# EAGLE design untitled (EAGLE 7.1.0)
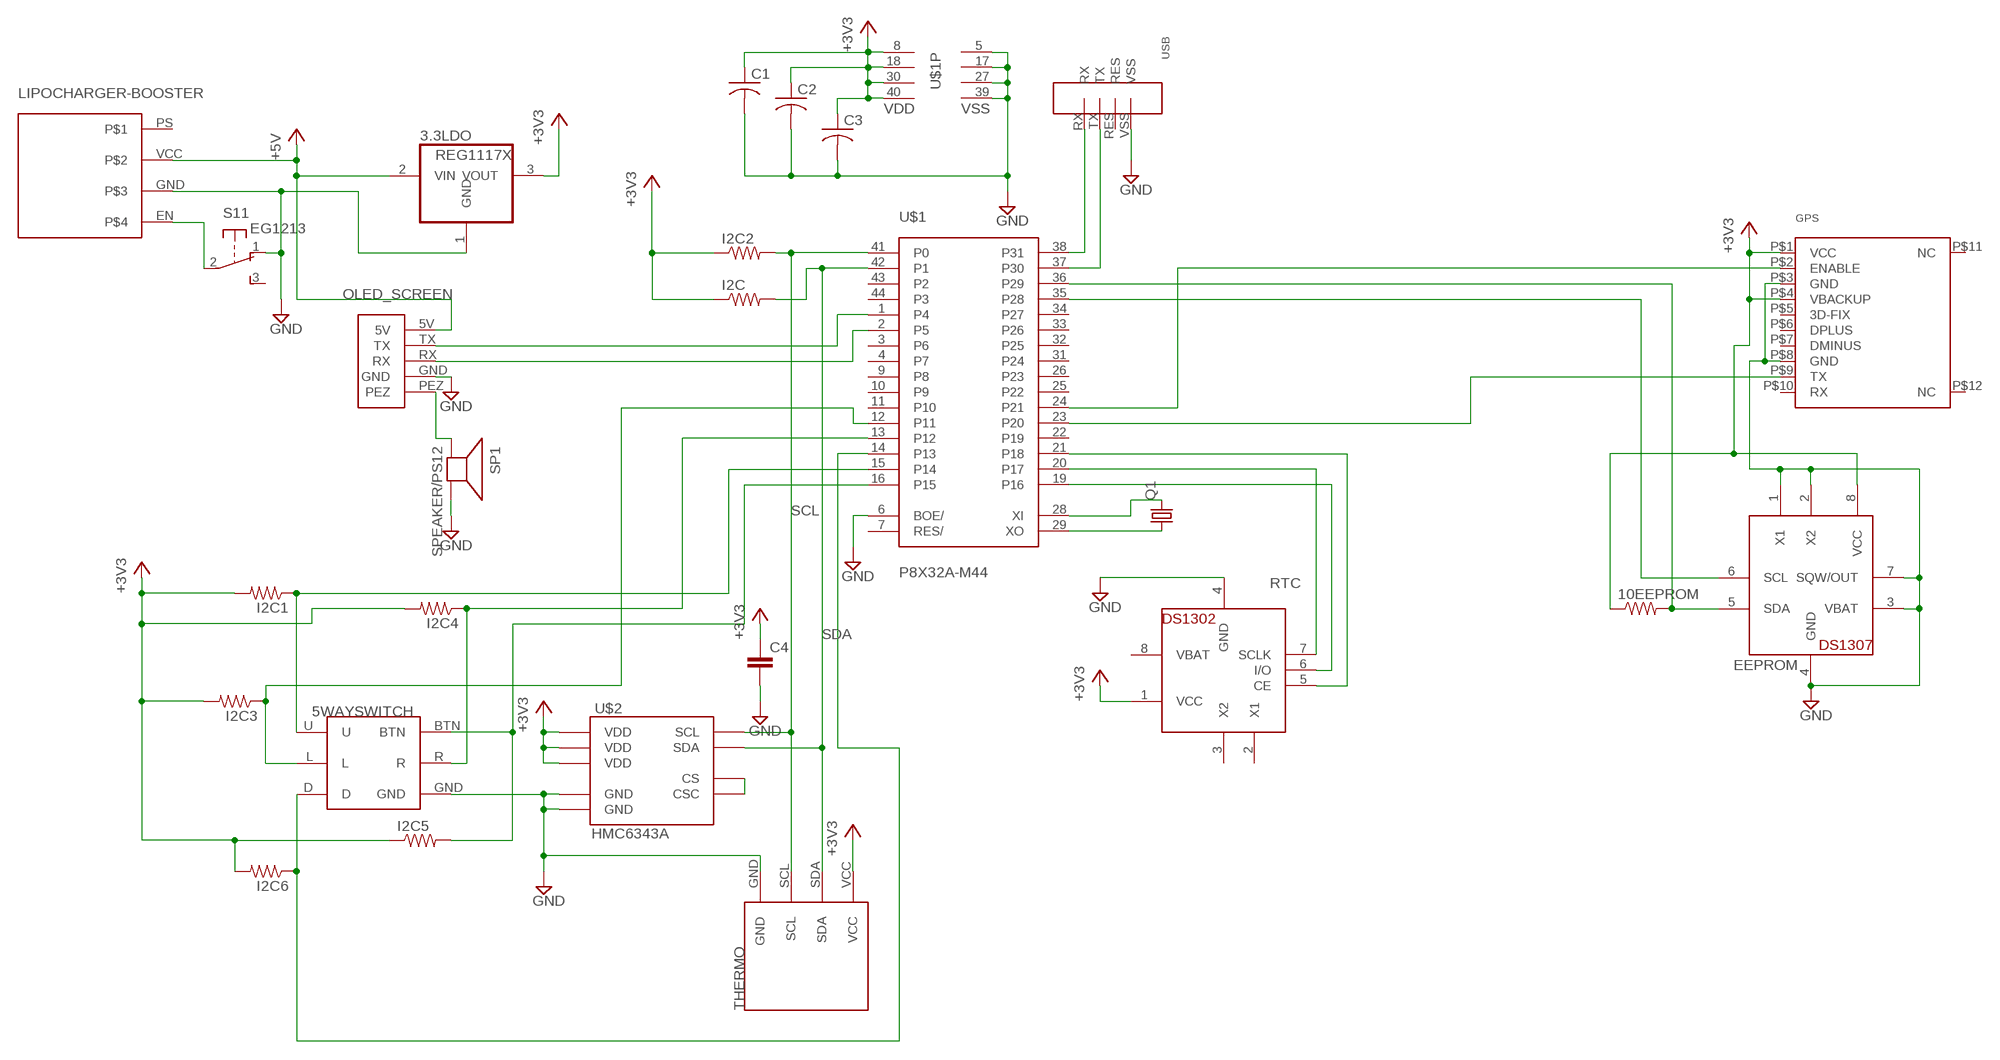
[diagram p0: schematic, sheet 1]

## Parts
3.3LDO  REG1117X  [TO252]
5WAYSWITCH  5-WAYSWITCH  [5-WAYSWITCH]
10EEPROM  R-US_R1005  [R1005]
C1  C-USC0603  [C0603]
C2  C-USC0603  [C0603]
C3  C-USC0603  [C0603]
C4  CAP0603  [0603]
EEPROM  DS1307  [DIL08]
GPS  GPS_FGPMMOPA6B  [FGPMMOPA6B]
I2C  R-US_R1005  [R1005]
I2C1  R-US_R1005  [R1005]
I2C2  R-US_R1005  [R1005]
I2C3  R-US_R1005  [R1005]
I2C4  R-US_R1005  [R1005]
I2C5  R-US_R1005  [R1005]
I2C6  R-US_R1005  [R1005]
LIPOCHARGER-BOOSTER  SFLIPO  [SFLIPO]
OLED_SCREEN  4DSCREEN  [4DSCREEN]
Q1  CRYSTALHC49S  [HC49/S]
RTC  DS1302  [DIL08-ROUND]
S1  EG1213  [EG1213]
SP1  SPEAKER/PS12  [PS12]
THERMO  SFTEMP  [SFTEMP]
U$1  P8X32A-M44  [P8X32A-M44]
U$2  HMC6343A  [LCC36]
USB  4PINUSB  [4PINUSB]

## Nets
+3V3: 3.3LDO.3(VOUT) 10EEPROM.1 C1.1 C2.1 C3.1 C4.1 EEPROM.8(VCC) GPS.P$1(VCC) GPS.P$4(VBACKUP) I2C1.2 I2C2.1 I2C3.2 I2C4.2 I2C5.1 I2C6.2 I2C.1 RTC.1(VCC) THERMO.VCC U$1.8(VDD) U$1.18(VDD) U$1.30(VDD) U$1.40(VDD) U$2.3(VDD) U$2.11(VDD) U$2.21(VDD)
+5V: 3.3LDO.2(VIN) LIPOCHARGER-BOOSTER.VCC OLED_SCREEN.5V
GND: 3.3LDO.1(GND) 5WAYSWITCH.GND C1.2 C2.2 C3.2 C4.2 EEPROM.1(X1) EEPROM.2(X2) EEPROM.3(VBAT) EEPROM.4(GND) EEPROM.7(SQW/OUT) GPS.P$3(GND) GPS.P$8(GND) LIPOCHARGER-BOOSTER.GND OLED_SCREEN.GND RTC.4(GND) S1.1(1:O) SP1.P$2(-) THERMO.GND U$1.5(VSS) U$1.6(BOE/) U$1.17(VSS) U$1.27(VSS) U$1.39(VSS) U$2.25(GND) U$2.29(GND) USB.VSS
N$1: Q1.2 U$1.28(XI)
N$2: Q1.1 U$1.29(XO)
N$3: GPS.P$9(TX) U$1.23(P20)
N$4: GPS.P$2(ENABLE) U$1.24(P21)
N$5: RTC.5(CE) U$1.21(P18)
N$6: RTC.6(I/O) U$1.19(P16)
N$7: U$1.38(P31) USB.RX
N$8: RTC.7(SCLK) U$1.20(P17)
N$9: U$1.37(P30) USB.TX
N$10: OLED_SCREEN.RX U$1.2(P5)
N$11: OLED_SCREEN.TX U$1.1(P4)
N$12: OLED_SCREEN.PEZ SP1.P$1(+)
N$13: LIPOCHARGER-BOOSTER.EN S1.2(1:P)
N$14: 5WAYSWITCH.U I2C1.1 U$1.15(P14)
N$15: 5WAYSWITCH.D I2C6.1 U$1.14(P13)
N$17: 5WAYSWITCH.L I2C3.1 U$1.12(P11)
N$18: 10EEPROM.2 EEPROM.5(SDA) U$1.36(P29)
N$19: EEPROM.6(SCL) U$1.35(P28)
N$20: 5WAYSWITCH.R I2C4.1 U$1.13(P12)
N$21: 5WAYSWITCH.BTN I2C5.2 U$1.16(P15)
N$22: U$2.22(CS) U$2.35(CSC)
SCL: I2C2.2 THERMO.SCL U$1.41(P0) U$2.32(SCL)
SDA: I2C.2 THERMO.SDA U$1.42(P1) U$2.36(SDA)
Unconnected: GPS.P$5(3D-FIX) GPS.P$6(DPLUS) GPS.P$7(DMINUS) GPS.P$10(RX) GPS.P$11(NC) GPS.P$12(NC) LIPOCHARGER-BOOSTER.PS RTC.2(X1) RTC.3(X2) S1.3(1:S) S1.MT1(MT) S1.MT2(MT) U$1.3(P6) U$1.4(P7) U$1.7(RES/) U$1.9(P8) U$1.10(P9) U$1.11(P10) U$1.22(P19) U$1.25(P22) U$1.26(P23) U$1.31(P24) U$1.32(P25) U$1.33(P26) U$1.34(P27) U$1.43(P2) U$1.44(P3) USB.RES

## Power pins joined to a net without a drawn wire
VBAT: RTC.8(VBAT)

## Library data of the parts
3.3LDO = burr-brown:REG1117: 800mA and 1A Low Dropout (LDO) Positive Regulator 1.8V, 2.5V, 2.85V, 3.3V, 5V, and Adj
5WAYSWITCH = 5-wayswitch:5-WAYSWITCH
10EEPROM I2C I2C1-I2C6 = adafruit:R-US_: RESISTOR, American symbol
C1-C3 = rcl:C-US: CAPACITOR, American symbol
C4 = SparkFun:CAP: Capacitor Standard 0603 ceramic capacitor, and 0.1" leaded capacitor.
EEPROM = adafruit:DS1307: DS1307 Real time clock (RTC) with battery backup ability. Talk to it via i2c
GPS = adafruit:GPS_FGPMMOPA6B: FGPMMOPA6B 16x16x0.6mm GPS Module NMEA Sentences: GGA, GSA, GSV, RMC, VTG General Specifications Chipset: MTK MT3329 Baud Rate: 9600bps (default) Update Rate: 1Hz (default) Cold Start: ~35s Operating Temp: -40 to 85°C DC Characteristics Supply Voltage: 3.2-5.0V Backup Battery Voltage: 2.0-4.3V Digital Logic (UART): 3.3V I(Tracking): 42mA I(Acquisition): 53mA I(BackupBattery): 10uA
LIPOCHARGER-BOOSTER = SFLipoPack:SFLIPO
OLED_SCREEN = 4dScreen:4DSCREEN
Q1 = crystal:CRYSTAL: CRYSTAL; OC_FARNELL: 1667008; OC_NEWARK: unknown
RTC = adafruit:DS1302: DS1302 - Real time clock with supercap trickle charger
S1 = adafruit:EG1213: E-Switch right-angle slide SPDT Part #EG1213 http://www.ladyada.net/library/eagle
SP1 = adafruit:SPEAKER: SPEAKER Source: Buerklin Added PS12 (for part # PS1240 piezo) http://www.ladyada.net/library/pcb/eaglelibrary.html
THERMO = SFTemp:SFTEMP
U$1 = parallax_propeller:P8X32A-M44
U$2 = SparkFun:HMC6343
USB = 4pinUSB:4PINUSB

## Board
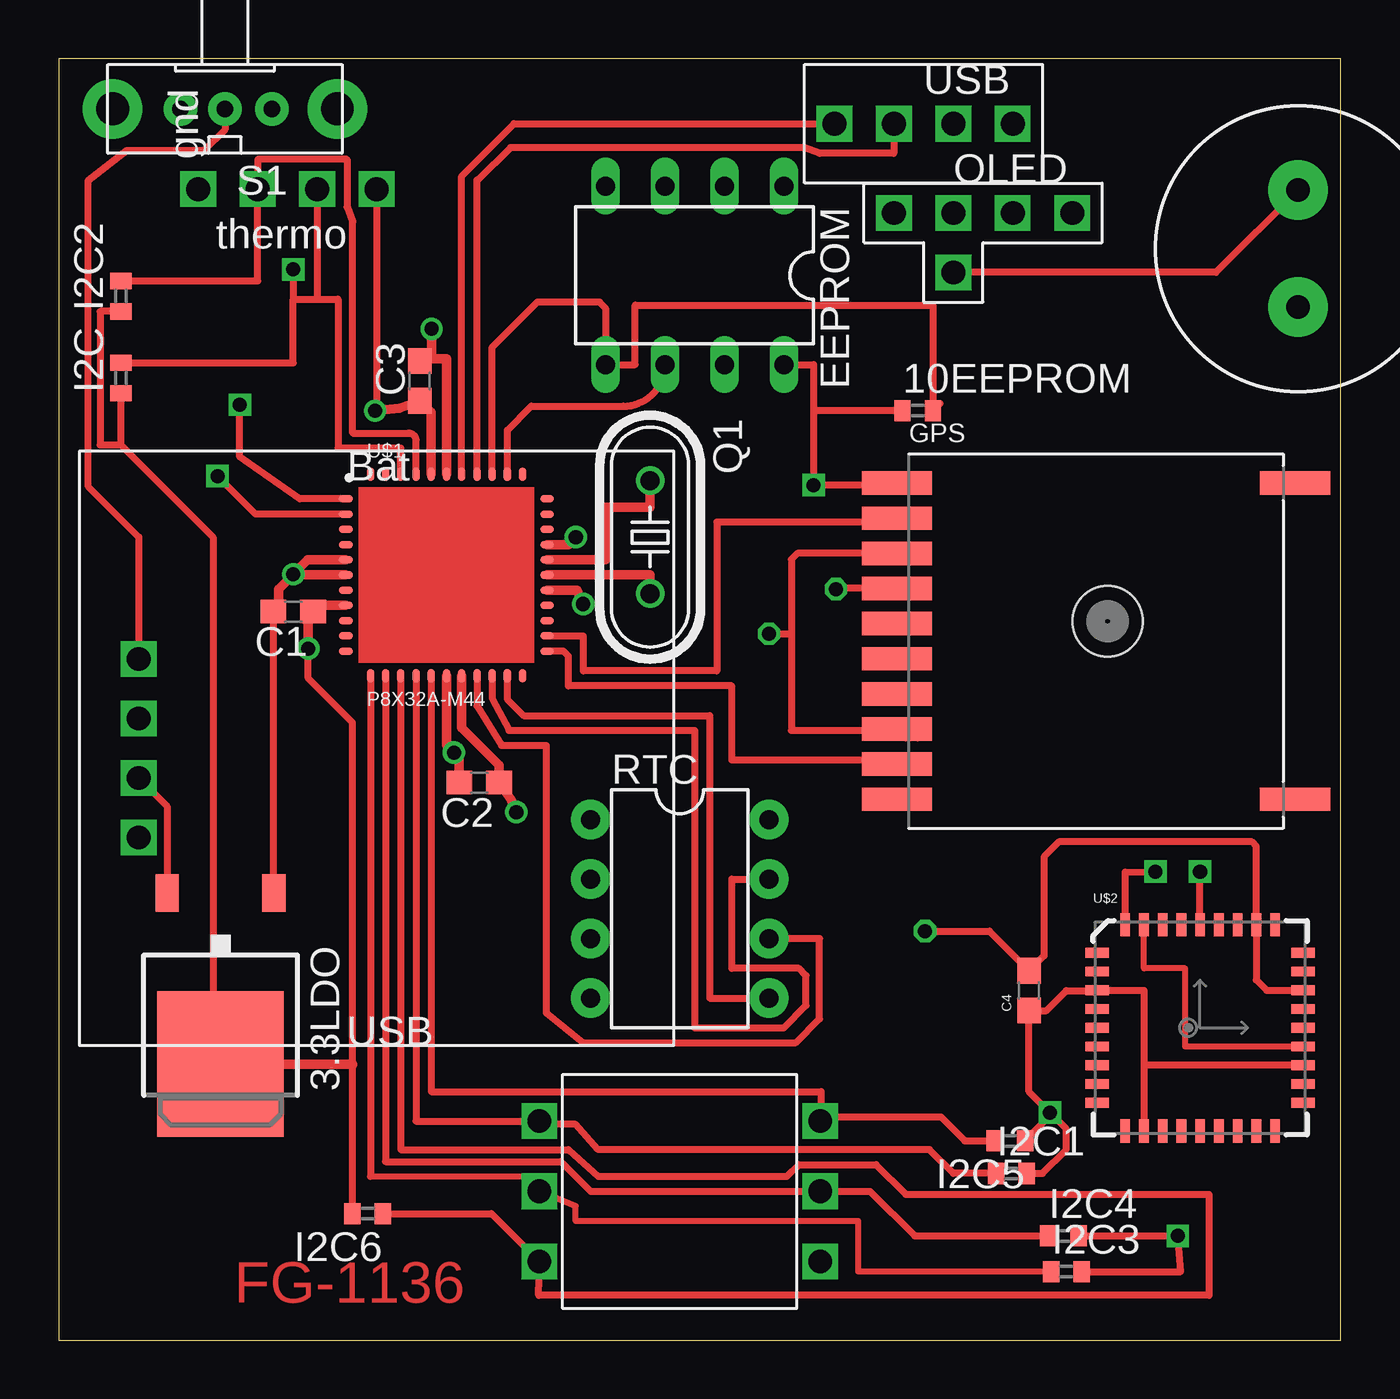
[diagram p1: board, top side]
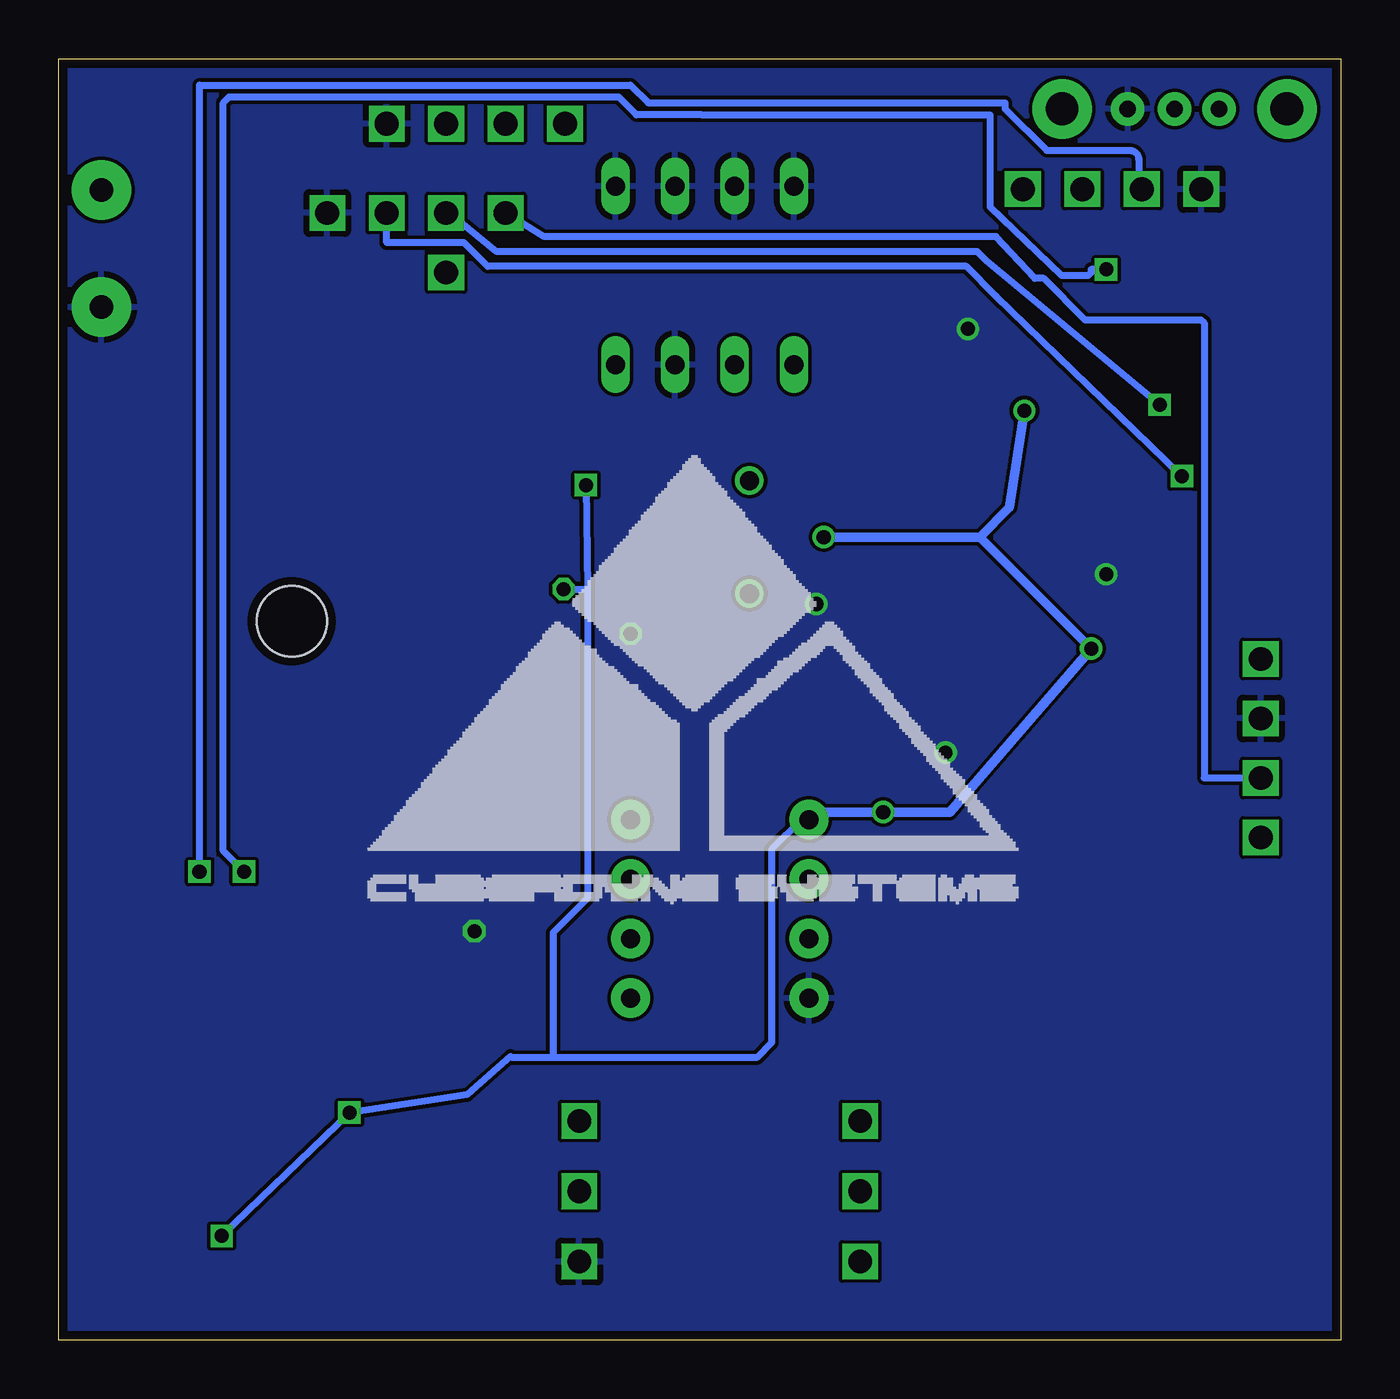
[diagram p2: board, bottom side, seen from below]

Size 54.79 x 54.73 mm. Coordinates in mm from the lower left corner, seen from the top.
Outline: 0,0 54.79,0 54.79,54.73 0,54.73 0,0
Copper layers (1*16): Top 0.0356mm / dielectric 1.5011mm / Bottom 0.0356mm
Design rules "LaenPCBOrder": minimum track width 6mil, minimum drill 13mil, track to track 6mil, track to pad 6mil, pad to pad 6mil, via to via 6mil, smd to smd 6mil, copper to edge 15mil, drill to drill 6mil, minimum pad ring 7mil, minimum via ring 7mil, stop-mask expansion 3mil, vias tented up to drill 0mil, thermal gap 10mil

### Footprints (pad centres in the part's own frame; a part is rotated, then mirrored left to right if it is on the bottom)
TO252 = smd 1 x 1.6: 1 -2.28,-4.8; 2 2.28,-4.8 | smd 5.4 x 6.2: 3 0,2.5
5-WAYSWITCH = drill 1.016 square: BTN 6,3; D -6,-3; GND 6,-3; L -6,0; R 6,0; U -6,3
R1005 = smd 0.7 x 0.9: 1 -0.65,0; 2 0.65,0
C0603 = smd 1.1 x 1: 1 -0.85,0; 2 0.85,0
0603 = smd 1.1 x 1: 1 -0.85,0; 2 0.85,0
DIL08 = drill 0.813 long: 1 -3.81,-3.81; 2 -1.27,-3.81; 3 1.27,-3.81; 4 3.81,-3.81; 5 3.81,3.81; 6 1.27,3.81; 7 -1.27,3.81; 8 -3.81,3.81
FGPMMOPA6B = smd 3 x 1: P$1 -8.5,6.75; P$2 -8.5,5.25; P$3 -8.5,3.75; P$4 -8.5,2.25; P$5 -8.5,0.75; P$6 -8.5,-0.75; P$7 -8.5,-2.25; P$8 -8.5,-3.75; P$9 -8.5,-5.25; P$10 -8.5,-6.75; P$11 8.5,6.75; P$12 8.5,-6.75 | hole 3: 0.5,0.85
SFLIPO = drill 1.016 square: EN -5.08,2.54; GND -5.08,0; PS -5.08,-5.08; VCC -5.08,-2.54
4DSCREEN = drill 1.016 square: 5V 0,-5.08; GND 0,2.54; PEZ 2.54,-2.54; RX 0,0; TX 0,-2.54
HC49/S = drill 0.813: 1 -2.413,0; 2 2.413,0
DIL08-ROUND = drill 0.813 pad 1.676: 1 -3.81,-3.81; 2 -1.27,-3.81; 3 1.27,-3.81; 4 3.81,-3.81; 5 3.81,3.81; 6 1.27,3.81; 7 -1.27,3.81; 8 -3.81,3.81
EG1213 = drill 0.7 pad 1.422: 1 -2,0; 2 0,0; 3 1.9,0 | drill 1.4 pad 2.54: MT1 -4.8,0; MT2 4.8,0
PS12 = drill 1 pad 2.54: P$1 -2.5,0; P$2 2.5,0
SFTEMP = drill 1.016 square: GND 0,2.54; SCL 0,0; SDA 0,-2.54; VCC 0,-5.08
P8X32A-M44 = smd 0.6 x 0.33: 1 -4.11,2.901; 2 -4.11,2.251; 3 -4.11,1.601; 4 -4.11,0.951; 5 -4.11,0.301; 6 -4.11,-0.349; 7 -4.11,-0.999; 8 -4.11,-1.649; 9 -4.11,-2.299; 10 -4.11,-2.949; 11 -4.11,-3.599; 23 4.49,-3.599; 24 4.49,-2.949; 25 4.49,-2.299; 26 4.49,-1.649; 27 4.49,-0.999; 28 4.49,-0.349; 29 4.49,0.301; 30 4.49,0.951; 31 4.49,1.601; 32 4.49,2.251; 33 4.49,2.901 | smd 0.33 x 0.6: 12 -3.06,-4.649; 13 -2.41,-4.649; 14 -1.76,-4.649; 15 -1.11,-4.649; 16 -0.46,-4.649; 17 0.19,-4.649; 18 0.84,-4.649; 19 1.49,-4.649; 20 2.14,-4.649; 21 2.79,-4.649; 22 3.44,-4.649; 34 3.44,3.951; 35 2.79,3.951; 36 2.14,3.951; 37 1.49,3.951; 38 0.84,3.951; 39 0.19,3.951; 40 -0.46,3.951; 41 -1.11,3.951; 42 -1.76,3.951; 43 -2.41,3.951; 44 -3.06,3.951
LCC36 = smd 1 x 0.42: 1 -4.4,3.2; 2 -4.4,2.4; 3 -4.4,1.6; 4 -4.4,0.8; 5 -4.4,0; 6 -4.4,-0.8; 7 -4.4,-1.6; 8 -4.4,-2.4; 9 -4.4,-3.2; 19 4.4,-3.2; 20 4.4,-2.4; 21 4.4,-1.6; 22 4.4,-0.8; 23 4.4,0; 24 4.4,0.8; 25 4.4,1.6; 26 4.4,2.4; 27 4.4,3.2 | smd 0.42 x 1: 10 -3.2,-4.4; 11 -2.4,-4.4; 12 -1.6,-4.4; 13 -0.8,-4.4; 14 0,-4.4; 15 0.8,-4.4; 16 1.6,-4.4; 17 2.4,-4.4; 18 3.2,-4.4; 28 3.2,4.4; 29 2.4,4.4; 30 1.6,4.4; 31 0.8,4.4; 32 0,4.4; 33 -0.8,4.4; 34 -1.6,4.4; 35 -2.4,4.4; 36 -3.2,4.4
4PINUSB = drill 1.016 square: RES 0,1.27; RX 0,-3.81; TX 0,-1.27; VSS 0,3.81

### Placement (x,y rotation side)
3.3LDO  6.92,14.29 180 top
5WAYSWITCH  26.54,6.35 0 top
10EEPROM  36.7,39.69 0 top
C1  10.03,31.11 180 top
C2  17.97,23.81 180 top
C3  15.43,40.96 90 top
C4  41.47,14.92 90 top
EEPROM  27.18,45.47 180 top
GPS  44.32,29.85 0 top
I2C  2.67,41.08 90 top
I2C1  40.7,7.11 0 top
I2C2  2.67,44.58 90 top
I2C3  43.05,2.92 0 top
I2C4  42.93,4.45 0 top
I2C5  40.64,8.51 180 top
I2C6  13.21,5.4 180 top
LIPOCHARGER-BOOSTER  8.51,26.54 0 top
OLED_SCREEN  40.77,48.13 270 top
Q1  25.27,34.29 270 top
RTC  26.54,18.41 270 top
S1  7.11,52.58 180 top
SP1  52.96,46.61 270 top
THERMO  8.51,49.15 90 top
U$1  16.38,33.02 0 top
U$2  48.77,13.34 0 top
USB  36.96,51.94 270 top

### Tracks (layer width: path | path; a pad name or v marks a point on that pad's centre or on a via)
+3V3  (via drill 0.6)
  Top 0.305: I2C3.2 47.94,2.92 v47.82,4.45 I2C4.2 | I2C6.2 12.56,11.75 | 12.56,11.79 12.56,26.37 10.67,28.26 v10.67,29.53 | GPS.P$1 35.74,36.51 v32.26,36.51 32.26,39.69 | 10EEPROM.1 32.26,39.69 | U$2.21 46.37,11.73 | 46.37,11.73 U$2.11 | 46.37,11.73 46.37,14.93 U$2.3 44.35,14.92 43.05,14.92 42.2,14.07 C4.1 41.46,10.61 v42.35,9.71 | GPS.P$4 33.24,32.09 v33.21,32.07 | 7.49,11.79 6.6,12.68 6.6,34.29 2.67,38.23 | THERMO.VCC 13.59,39.75 v13.53,39.69 | I2C.1 2.67,38.23 | I2C2.1 1.78,43.93 1.78,38.23 2.67,38.23 | EEPROM.8 32.26,41.66 32.26,39.69 | I2C5.1 42.35,9.57 v42.35,9.71 | I2C1.2 42.04,7.11 43.05,8.13 43.05,9.02 v42.35,9.71
  Top 0.406: U$1.8 10.88,31.37 C1.1 10.67,30.9 v10.67,29.53 | v19.56,22.54 19.34,23.07 C2.1 18.82,24.55 17.22,26.15 U$1.18 | U$1.30 21.78,33.97 v22.1,34.29 | v13.53,39.69 14.58,39.79 C3.1 15.92,39.61 U$1.40 | 3.3LDO.3 7.49,11.79 12.56,11.79 12.56,11.75
  Bottom 0.305: v47.82,4.45 v42.35,9.71 37.34,10.48 35.47,12.11 35.43,12.07 33.66,12.07 | v32.26,36.51 32.19,32.07 | v33.21,32.07 32.19,32.07 | RTC.1 23.05,22.22 24.32,20.95 24.32,12.7 24.96,12.07 33.66,12.07 | 32.19,32.07 32.19,18.86 33.66,17.4 33.66,12.07
  Bottom 0.406: v22.1,34.29 15.43,34.29 | 15.43,34.29 v10.67,29.53 16.7,22.54 v19.56,22.54 22.73,22.54 RTC.1 | v13.53,39.69 14.16,35.56 15.43,34.29
+5V
  Top 0.305: LIPOCHARGER-BOOSTER.VCC 4.64,22.79 3.3LDO.2
  Bottom 0.305: LIPOCHARGER-BOOSTER.VCC 5.84,24 5.84,43.43 5.97,43.56 10.92,43.56 12.7,45.34 13.08,45.34 14.73,47.12 34.04,47.12 OLED_SCREEN.5V
GND  (via drill 0.6)
  Top 0.305: U$2.25 51.61,14.93 51.17,15.38 U$2.29 51.17,21.09 50.99,21.27 42.74,21.27 42.1,20.64 42.1,16.41 C4.2 39.77,17.46 v37.02,17.46 | 37.02,26.04 36.7,25.72 36.38,25.72 | 36.38,25.72 36.2,25.72 GPS.P$8 | GPS.P$3 31.56,33.59 31.3,33.34 31.3,30.16 | 31.3,30.16 31.3,26.04 36.07,26.04 36.38,25.72 | v30.35,30.16 31.3,30.16 | 3.3LDO.1 9.18,19.09 C1.2
  Top 0.406: U$1.39 16.57,41.91 16,41.91 | U$1.6 10,32.67 | 10,32.67 9.4,32.07 9.4,31.33 C1.2 | U$1.5 10.65,33.32 v10.03,32.7 10,32.67 | U$1.27 22.14,32.02 v22.42,31.43 | C3.2 15.43,41.91 16,41.91 | U$1.17 16.57,25.4 v16.89,25.08 17.12,24.85 C2.2 | v15.94,43.18 15.94,41.97 16,41.91
  pour Bottom: 0.51,54.48 54.67,54.48 54.42,0.25 0.51,0.13
N$1
  Top 0.406: U$1.28 25.27,32.67 Q1.2
N$2
  Top 0.406: U$1.29 23.37,33.32 23.37,35.56 25.27,35.56 Q1.1
N$3
  Top 0.305: GPS.P$9 35.65,24.76 28.77,24.76 28.77,27.94 21.78,27.94 21.78,29.21 21.57,29.42 U$1.23
N$4
  Top 0.305: GPS.P$2 35.65,34.92 28.13,34.92 28.13,28.57 22.42,28.57 22.42,30.07 U$1.24
N$5
  Top 0.305: RTC.5 27.81,14.61 27.81,26.67 19.88,26.67 19.17,27.37 U$1.21
N$6
  Top 0.305: RTC.6 32.51,17.14 32.51,13.72 31.5,12.7 22.42,12.7 20.83,13.97 20.83,25.4 18.92,25.4 17.87,27.08 U$1.19
N$7
  Top 0.305: U$1.38 17.22,49.71 19.46,51.94 USB.RX
N$8
  Top 0.305: RTC.7 28.77,19.68 28.77,15.88 31.62,15.88 31.94,15.56 31.94,14.29 30.99,13.34 27.18,13.34 27.18,26.04 19.24,26.04 18.52,27.39 U$1.20
N$9
  Top 0.305: U$1.37 17.87,49.53 17.91,49.53 19.3,50.93 31.88,50.93 32.51,50.67 35.69,50.67 USB.TX
N$10  (via drill 0.6)
  Top 0.305: U$1.2 8.42,35.27 v6.8,36.89
  Bottom 0.305: v6.8,36.89 14.73,44.58 16,45.85 36.45,45.85 37.46,46.86 40.77,46.86 OLED_SCREEN.RX
N$11  (via drill 0.6)
  Top 0.305: U$1.1 10.31,35.92 7.75,37.72 v7.75,39.94
  Bottom 0.305: v7.75,39.94 15.02,45.98 15.15,46.1 15.53,46.48 36.07,46.48 38.1,48.13 OLED_SCREEN.TX
N$12
  Top 0.305: SP1.P$1 49.44,45.59 OLED_SCREEN.PEZ
N$13
  Top 0.305: S1.2 7.11,51.69 6.22,50.8 2.92,50.8 1.27,49.53 1.27,36.45 3.43,34.29 LIPOCHARGER-BOOSTER.EN
N$14
  Top 0.305: U$1.15 15.27,9.35 5WAYSWITCH.U 20.69,9.21 22.1,9.21 23.05,8.13 37.21,8.13 38.23,7.11 I2C1.1
N$15
  Top 0.305: U$1.14 14.62,8.13 21.78,8.13 23.05,6.98 31.12,6.98 31.62,7.49 34.93,7.49 36.2,6.22 49.15,6.22 49.15,1.9 20.51,1.9 5WAYSWITCH.D 18.5,5.4 I2C6.1
N$17
  Top 0.254: I2C3.1 34.16,2.92 34.16,5.08 22.1,5.08 22.1,5.71 5WAYSWITCH.L 20.54,6.98 13.32,6.98
  Top 0.305: U$1.12 13.32,6.98
N$18
  Top 0.305: 37.67,40 10EEPROM.2 37.35,44.2 24.64,44.2 24.64,41.66 EEPROM.5 23.37,44.07 23.11,44.32 20.45,44.32 18.52,42.4 U$1.36
N$19
  Top 0.305: U$1.35 19.18,38.86 20.19,39.88 24.13,39.88 arc90 EEPROM.6
N$20
  Top 0.305: U$1.13 13.97,7.62 21.46,7.62 22.73,6.35 5WAYSWITCH.R | 32.58,6.35 5WAYSWITCH.R | I2C4.1 36.58,4.45 34.67,6.35 5WAYSWITCH.R
N$21
  Top 0.254: 32.54,9.52 5WAYSWITCH.BTN
  Top 0.305: U$1.16 15.92,10.61 32.58,10.61 32.58,9.35 5WAYSWITCH.BTN | 32.54,9.52 37.7,9.52 38.72,8.51 I2C5.2
N$22
  Top 0.254: U$2.22 48.13,12.54 48.13,15.88 46.37,15.88 U$2.35
SCL  (via drill 0.6)
  Top 0.305: U$1.41 15.27,38.42 arc90 14.96,38.73 12.57,38.73 12.57,47.75 12.32,48.39 12.32,50.42 8.51,50.42 THERMO.SCL 8.51,45.23 I2C2.2 | U$2.32 v48.77,20
  Bottom 0.305: THERMO.SCL arc90 8.64,49.28 8.64,50.42 arc-90 9.02,50.8 12.57,50.8 14.35,52.58 14.35,52.83 29.59,52.83 30.35,53.59 48.77,53.59 v48.77,20
SDA  (via drill 0.6)
  Top 0.305: U$1.42 14.62,38.1 11.94,38.1 11.94,44.45 11.05,44.45 | 10.03,44.45 11.05,44.45 | U$2.36 45.57,19.98 v46.86,20 | v10.03,45.72 10.03,44.45 | THERMO.SDA 11.05,44.45 | I2C.2 10.03,41.73 10.03,44.45
  Bottom 0.305: v10.03,45.72 10.54,45.72 | 10.54,45.72 10.67,45.72 | 10.54,45.72 10.8,45.47 11.94,45.47 14.99,48.39 14.99,52.32 27.3,52.32 30.1,52.32 30.86,53.09 47.5,53.09 47.75,52.83 47.75,20.89 v46.86,20

### Text on the board
Top: FG-1136